# Altium schematic sheet Sheet5.SchDoc
size A4; SheetNumber: 1; SheetTotal: 1
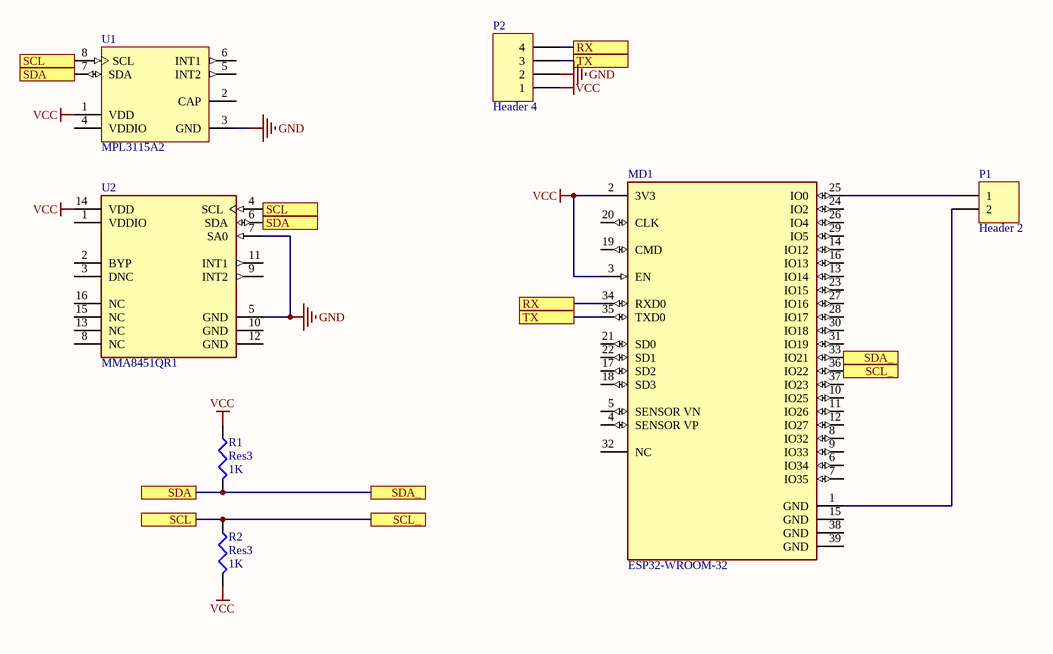
[diagram p0: Sheet5.SchDoc]

## Parts
MD1  ESP32-WROOM-32  [FP-ESP32-WROOM-32-MFG]
P1  Header 2  [HDR1X2]
P2  Header 4  [HDR1X4]
R1  Res3  value 1K  [J1-0603]
R2  Res3  value 1K  [J1-0603]
U1  MPL3115A2  [FRES-2153-01_V]
U2  MMA8451QR1  [FP-SOT1676-1-IPC_A]

## Ports
RX, SCL, SCL_, SDA, SDA_, TX

## Nets
GND: P2.2 U1.3(GND) U2.5(GND) U2.7(SA0)
VCC: MD1.2(3V3) MD1.3(EN) P2.1 R1.1 R2.2 U1.1(VDD) U2.14(VDD)
RX: MD1.34(RXD0) P2.4 ; port RX
SCL: MD1.36(IO22) R2.1 U1.8(SCL) U2.4(SCL) ; port SCL, port SCL_
SDA: MD1.33(IO21) R1.2 U1.7(SDA) U2.6(SDA) ; port SDA, port SDA_
TX: MD1.35(TXD0) P2.3 ; port TX
NetMD1_1: MD1.1(GND) P1.2
NetMD1_25: MD1.25(IO0) P1.1

Not connected (* = marked no-connect by the designer): MD1 4(SENSOR_VP) 5(SENSOR_VN) 6(IO34) 7(IO35) 8(IO32) 9(IO33) 10(IO25) 11(IO26) 12(IO27) 13(IO14) 14(IO12) 15(GND) 16(IO13) 17(SD2) 18(SD3) 19(CMD) 20(CLK) 21(SD0) 22(SD1) 23(IO15) 24(IO2) 26(IO4) 27(IO16) 28(IO17) 29(IO5) 30(IO18) 31(IO19) 32(NC) 37(IO23) 38(GND) 39(GND); U1 2(CAP) 4(VDDIO) 5(INT2) 6(INT1); U2 1(VDDIO) 2(BYP) 3(DNC) 8(NC) 9(INT2) 10(GND) 11(INT1) 12(GND) 13(NC) 15(NC) 16(NC)

## Library data of the parts
MD1 = CMP-194065-000008-1: RX TXRX MOD WIFI SURFACE MOUNT; Frequency: 2.5GHz; Sensitivity: -98dBm; Operating Supply Voltage: 3.6V; Data Rate: 150Mbps; Weight: 0.088185oz; Package Quantity: 550; Min Operating Temperature: -40°C; Mount: Surface Mount; Max Operating Temperature: 85°C; Packaging: Cut Tape; Case/Package: SMD/SMT
P1 = Header 2: Header, 2-Pin; LatestRevisionDate: 17-Jul-2002; LatestRevisionNote: Re-released for DXP Platform.; Publisher: Altium Limited
P2 = Header 4: Header, 4-Pin; LatestRevisionDate: 17-Jul-2002; LatestRevisionNote: Re-released for DXP Platform.; Publisher: Altium Limited
R1 R2 = Res3: Resistor; Published: 8-Jun-2000; LatestRevisionDate: 29-May-2009; LatestRevisionNote: IPC-7351 Footprint Added.; PackageReference: J1-0603; Publisher: Altium Limited; PackageDescription: Chip Resistor
U1 = CMP-1261-00002-2: Xtrinsic I2C Precision Altimeter, 1.95 to 3.6 V, -40 to 85 degC, 8-Pin LGA (2153-01), RoHS, Tray; Manufacturer: Freescale Semiconductor; fSCL@400 pF: 400 KHz Max.; VDDIO: 1.62 to 3.6 V; fSCL@20 pF: 4 MHz Max.; Operating Temperature Range: -40 to 85 degC; PackageDescription: 8-Pin Land Grid Array, Body 5 x 3 mm, Pitch 1.25 mm; Packing: Tray; ComponentLink1Description: Manufacturer URL; ComponentLink2Description: Datasheet; ComponentLink3URL: http://cache.freescale.com/files/shared/doc/package_info/98ASA00260D.pdf; RoHS: TRUE; Mounting Technology: Surface Mount; ComponentLink3Description: Package Specification; VDD: 1.95 to 3.6 V; ComponentLink1URL: http://www.freescale.com/; DatasheetVersion: Rev. 3.0; PartNumber: MPL3115A2; ComponentLink2URL: http://cache.freescale.com/files/sensors/doc/data_sheet/MPL3115A2.pdf; PackageVersion: Rev. O
U2 = CMP-2000-06724-2: ACCELEROMETER 2-8G I2C 16QFN; Min Supply Voltage (DC): 1.95V; Max Supply Voltage: 3.6V; Resolution: 14b; Axis: X, Y, Z; Bandwidth: 400Hz; Output Type: Digital; Sensor Type: 3 Axis; Mount: Surface Mount; Case/Package: QFN; Interface: I2C; Package Quantity: 1000; Radiation Hardening: No; Length: 3mm; Max Operating Temperature: 85°C; Weight: 0.001122oz; Number of Pins: 16; Packaging: Cut Tape; REACH SVHC: No SVHC; Max Supply Voltage (DC): 3.6V; Depth: 3mm; Min Operating Temperature: -40°C; Min Supply Voltage: 1.95V; Contact Plating: Gold